# EAGLE schematic PhychipDevelopmentBoard (EAGLE 6.6.0)
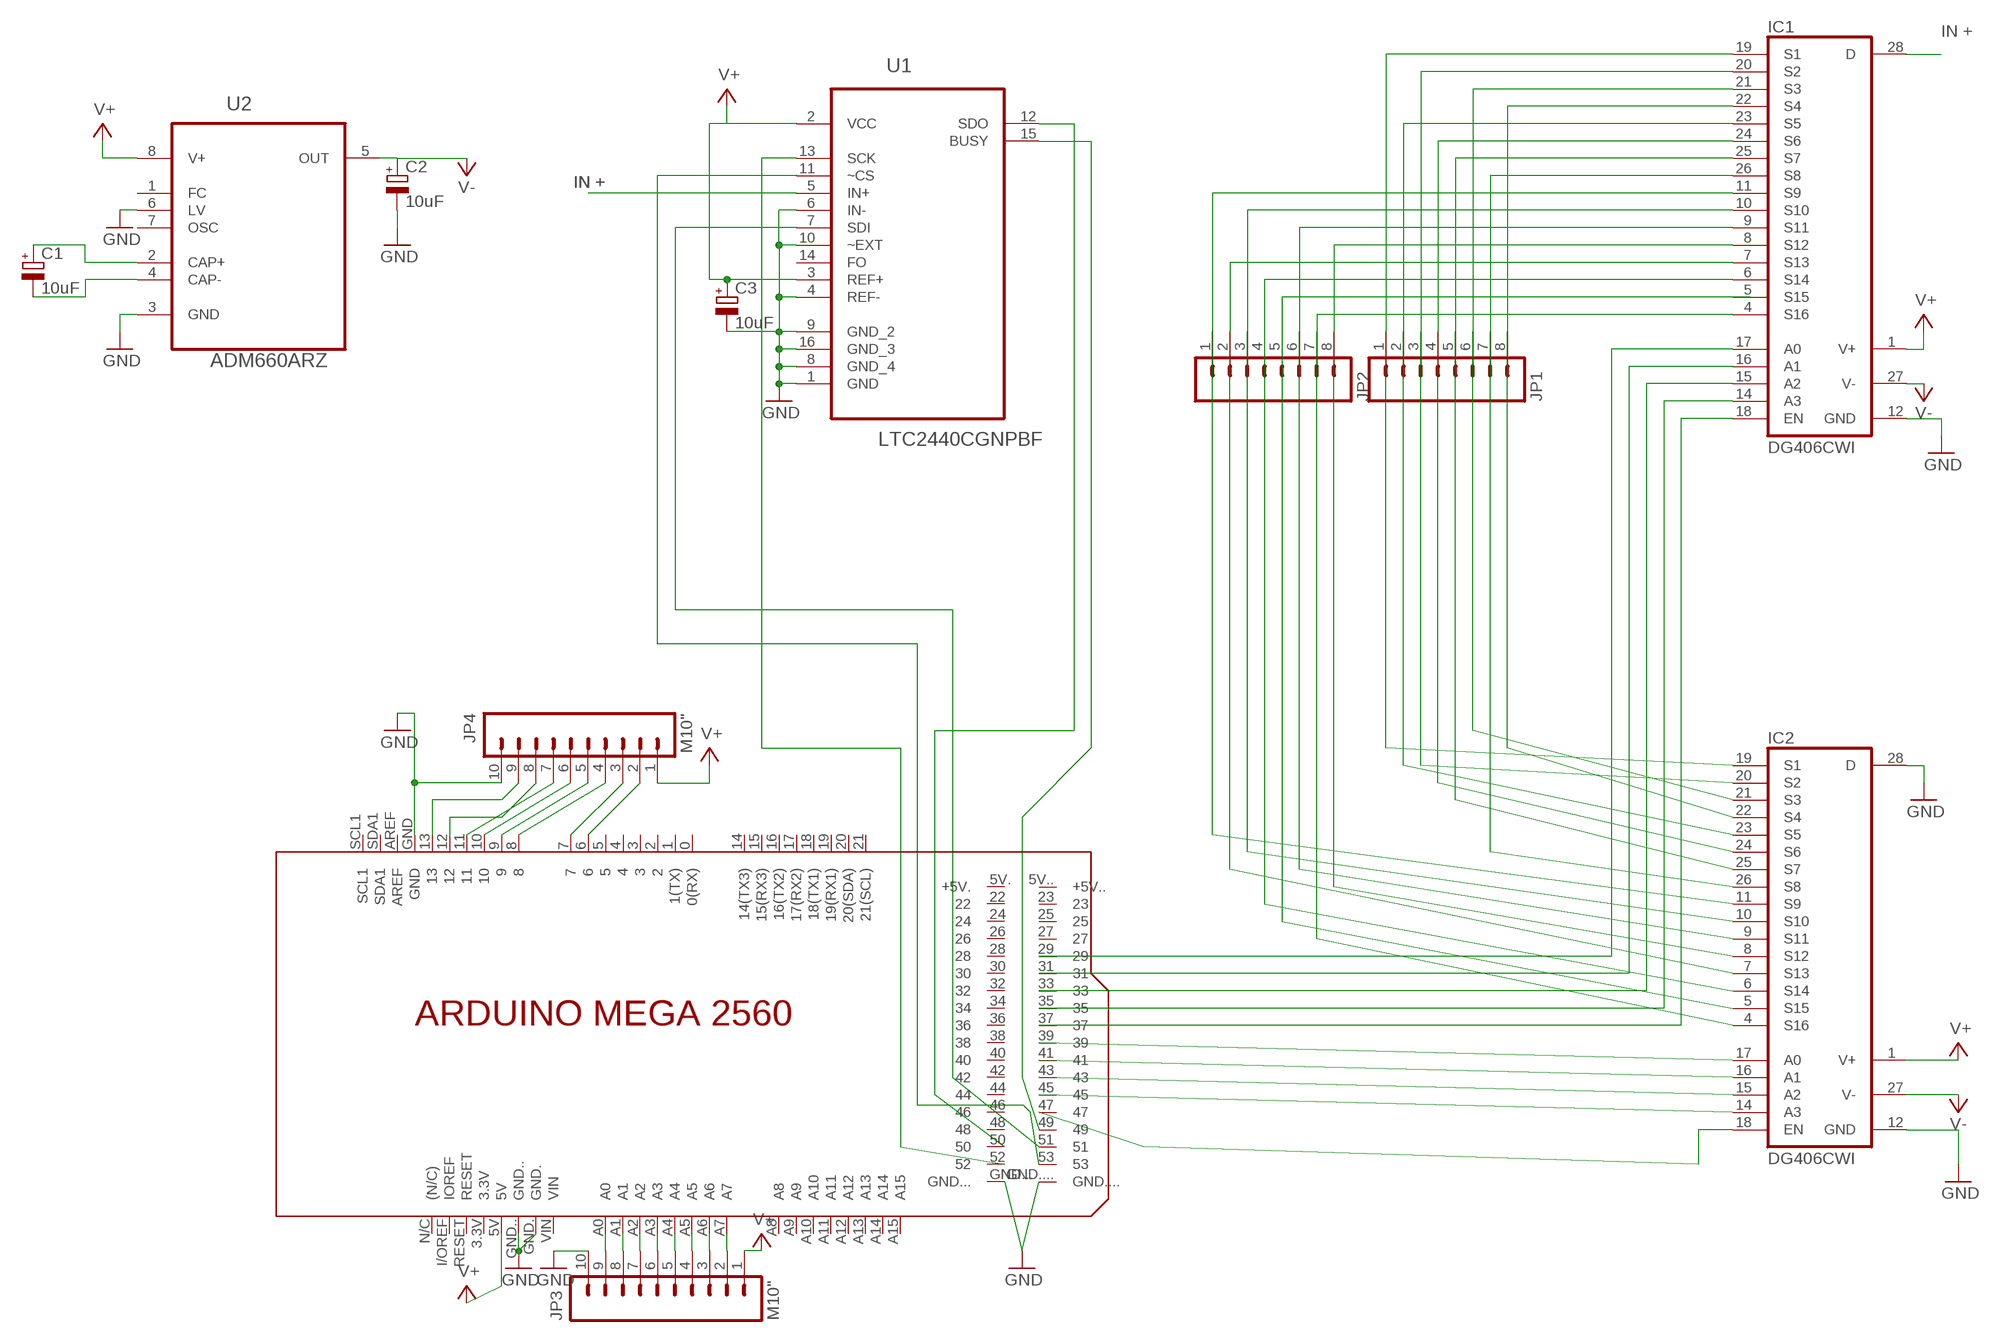
[diagram p0: schematic, sheet 1]

## Parts
C1  10uF  CPOL-EU153CLV-0505  [153CLV-0505]
C2  10uF  CPOL-EU153CLV-0505  [153CLV-0505]
C3  10uF  CPOL-EU153CLV-0505  [153CLV-0505]
IC1  DG406CWI  [SO28L]
IC2  DG406CWI  [SO28L]
JP1  M08  [1X08]
JP2  M08  [1X08]
JP3  M10"  [1X10]
JP4  M10"  [1X10]
PCB1  ARDUINO_MEGA2560  [ARDUINO_MEGA2560]
U1  LTC2440CGNPBF  [SOP63P600X175-16N]
U2  ADM660ARZ  [SOIC127P600X175-8N]

## Nets
GND: C2.- C3.- IC1.12(GND) IC2.12(GND) IC2.28(D) JP3.10 JP4.10 PCB1.GND PCB1.GND. PCB1.GND.. PCB1.GND... PCB1.GND.... U1.1(GND) U1.4(REF-) U1.6(IN-) U1.8(GND_4) U1.9(GND_2) U1.10(~EXT) U1.16(GND_3) U2.3(GND) U2.6(LV)
IN+: IC1.28(D) U1.5(IN+)
N$1: C1.+ U2.2(CAP+)
N$2: C1.- U2.4(CAP-)
N$3: PCB1.52 U1.13(SCK)
N$4: PCB1.50 U1.12(SDO)
N$5: PCB1.51 U1.7(SDI)
N$6: PCB1.49 U1.15(BUSY)
N$7: PCB1.53 U1.11(~CS)
N$8: IC2.18(EN) PCB1.47
N$9: IC2.14(A3) PCB1.45
N$10: IC2.15(A2) PCB1.43
N$11: IC2.16(A1) PCB1.41
N$12: IC2.17(A0) PCB1.39
N$13: IC1.18(EN) PCB1.37
N$14: IC1.14(A3) PCB1.35
N$15: IC1.15(A2) PCB1.33
N$16: IC1.16(A1) PCB1.31
N$17: IC1.17(A0) PCB1.29
N$18: IC1.19(S1) IC2.19(S1) JP1.1
N$19: IC1.20(S2) IC2.20(S2) JP1.3
N$20: IC1.21(S3) IC2.21(S3) JP1.6
N$21: IC1.22(S4) IC2.22(S4) JP1.8
N$22: IC1.23(S5) IC2.23(S5) JP1.2
N$23: IC1.24(S6) IC2.24(S6) JP1.4
N$24: IC1.25(S7) IC2.25(S7) JP1.5
N$25: IC1.26(S8) IC2.26(S8) JP1.7
N$26: IC1.11(S9) IC2.11(S9) JP2.1
N$27: IC1.10(S10) IC2.10(S10) JP2.3
N$28: IC1.9(S11) IC2.9(S11) JP2.6
N$29: IC1.8(S12) IC2.8(S12) JP2.8
N$30: JP3.9 PCB1.A0
N$31: JP3.8 PCB1.A1
N$32: JP3.7 PCB1.A2
N$33: JP3.6 PCB1.A3
N$34: JP3.5 PCB1.A4
N$35: JP3.4 PCB1.A5
N$36: JP3.3 PCB1.A6
N$37: JP3.2 PCB1.A7
N$38: IC1.7(S13) IC2.7(S13) JP2.2
N$39: JP4.9 PCB1.13
N$40: IC1.6(S14) IC2.6(S14) JP2.4
N$41: IC2.5(S15) JP2.5
N$42: IC1.4(S16) IC2.4(S16) JP2.7
N$43: JP4.8 PCB1.12
N$44: JP4.7 PCB1.11
N$45: JP4.6 PCB1.10
N$46: JP4.5 PCB1.9
N$47: JP4.4 PCB1.8
N$48: JP4.3 PCB1.7
N$49: JP4.2 PCB1.6
V+: C3.+ IC1.1(V+) IC2.1(V+) JP3.1 JP4.1 PCB1.5V U1.2(VCC) U1.3(REF+) U2.8(V+)
V-: C2.+ IC1.27(V-) IC2.27(V-) U2.5(OUT)
Unconnected: IC1.5(S15) PCB1.0(0(RX)) PCB1.1(1(TX)) PCB1.2 PCB1.3 PCB1.3.3V PCB1.4 PCB1.5 PCB1.5V.(+5V.) PCB1.5V..(+5V..) PCB1.14(14(TX3)) PCB1.15(15(RX3)) PCB1.16(16(TX2)) PCB1.17(17(RX2)) PCB1.18(18(TX1)) PCB1.19(19(RX1)) PCB1.20(20(SDA)) PCB1.21(21(SCL)) PCB1.22 PCB1.23 PCB1.24 PCB1.25 PCB1.26 PCB1.27 PCB1.28 PCB1.30 PCB1.32 PCB1.34 PCB1.36 PCB1.38 PCB1.40 PCB1.42 PCB1.44 PCB1.46 PCB1.48 PCB1.A8 PCB1.A9 PCB1.A10 PCB1.A11 PCB1.A12 PCB1.A13 PCB1.A14 PCB1.A15 PCB1.AREF PCB1.I/OREF(IOREF) PCB1.N/C((N/C)) PCB1.RESET PCB1.SCL1 PCB1.SDA1 PCB1.VIN U1.14(FO) U2.1(FC) U2.7(OSC)

## Notes on the sheet
- IN +
- IN + | IN +

## Library data of the parts
C1-C3 = rcl:CPOL-EU: POLARIZED CAPACITOR, European symbol
IC1 IC2 = maxim:DG406CWI: ANALOG MULTIPLEXER; MF: MAXIM; MPN: DG406CWI; OC_FARNELL: unknown; OC_NEWARK: 77C6458
JP1 JP2 = SparkFun:M08: Header 8 Standard 8-pin 0.1" header. Use with straight break away headers (SKU : PRT-00116), right angle break away headers (PRT-00553), swiss pins (PRT-00743), machine pins (PRT-00117), and female headers (PRT-00115).
JP3 JP4 = SparkFun:M10: Header 10 Standard 10-pin 0.1" header. Use with straight break away headers (SKU : PRT-00116), right angle break away headers (PRT-00553), swiss pins (PRT-00743), machine pins (PRT-00117), and female headers (PRT-00115).
PCB1 = E14_Arduino_revB:ARDUINO_MEGA2560: Device for representing an Arduino Mega 2560 board with a footprint in an EAGLE design. Created by Dave Young for Element14. More EAGLE documentation at: http://www.element14.com/community/community/knode/cadsoft_eagle
U1 = LTC_By_element14_Batch_1:LTC2440CGNPBF: ADC; MPN: LTC2440CGN#PBF; OC_FARNELL: 1651798; OC_NEWARK: 56M5608; PACKAGE: SSOP-16; SUPPLIER: Linear Technology
U2 = Analog Devices_By_element14_Batch_1:ADM660ARZ: CMOS Switched-Capacitor Voltage Converters; MPN: ADM660ARZ; OC_FARNELL: 1661070; OC_NEWARK: 19M8699; PACKAGE: SOIC-8; SUPPLIER: Analog Devices